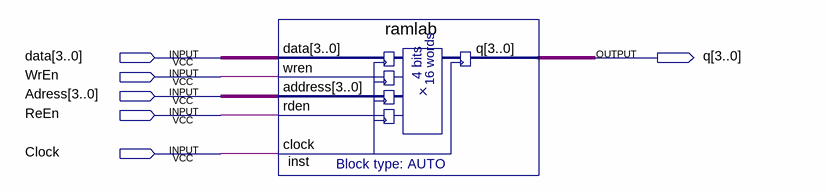
[diagram p0: schematic sheet]
// Quartus schematic 2500510027.bdf as structural Verilog: 1 symbols, 6 pins
module \2500510027  (
  input  [3:0] data,
  input  WrEn,
  input  [3:0] Adress,
  input  ReEn,
  input  Clock,
  output [3:0] q
);

  ramlab inst (.data(data), .wren(WrEn), .address(Adress), .rden(ReEn), .clock(Clock), .q(q));
endmodule
